# EAGLE design talkie (EAGLE 9.1.1)

## Sheet 1 of 2: ANALOG
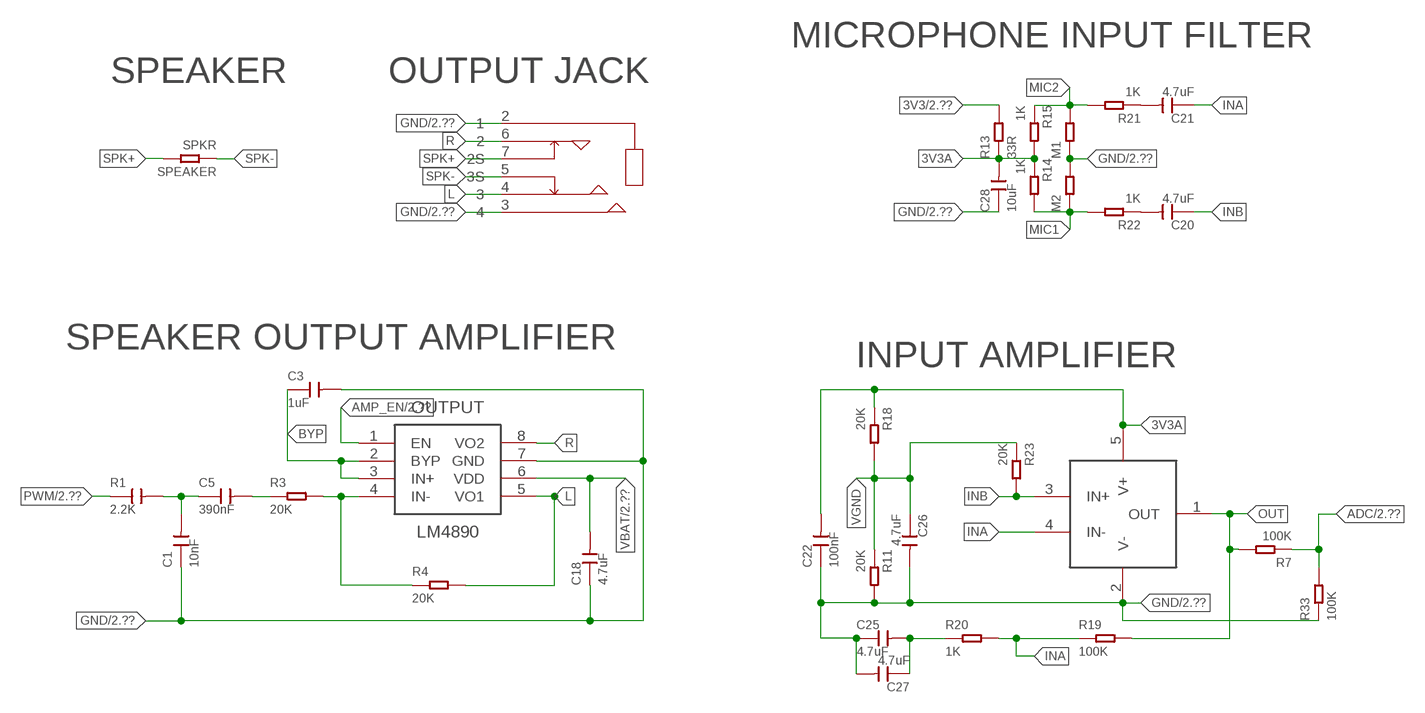
[diagram p0: schematic, sheet 1]

### Parts
C1  10nF  CERAMIC-10NF-50V-10%-X7R(0402)  [C0402]
C3  1uF  CERAMIC-1UF-10V-10%-X5R(0402)  [C0402]
C5  390nF  CERAMIC-470NF-10V-10%-X5R(0402)  [C0402]
C18  4.7uF  CERAMIC-4.7UF-6.3V-20%-X5R(0402)  [C0402]
C20  4.7uF  CERAMIC-4.7UF-6.3V-20%-X5R(0402)  [C0402]
C21  4.7uF  CERAMIC-4.7UF-6.3V-20%-X5R(0402)  [C0402]
C22  100nF  CERAMIC-100NF-25V-10%-X7R(0402)  [C0402]
C25  4.7uF  CERAMIC-4.7UF-6.3V-20%-X5R(0402)  [C0402]
C26  4.7uF  CERAMIC-4.7UF-6.3V-20%-X5R(0402)  [C0402]
C27  4.7uF  CERAMIC-4.7UF-6.3V-20%-X5R(0402)  [C0402]
C28  10uF  CERAMIC-10UF-10V-10%-X5R(0603)  [C0603]
JACK  PJ-342  [PJ-342-6P]
M1  RES-1206  [R1206]
M2  RES-1206  [R1206]
OUTPUT  LM4890  [8-MSOP]
PREAMP  MCP6001UT-I  [SOT-23-5]
R1  2.2K  CERAMIC-10NF-50V-10%-X7R(0402)  [C0402]
R3  20K  RES-0402  [R0402]
R4  20K  RES-0402  [R0402]
R7  100K  SMD-RES-100K-1%-1/16W(0402)  [R0402]
R11  20K  RES-0402  [R0402]
R13  33R  SMD-RES-33R-1%-1/16W(0402)  [R0402]
R14  1K  SMD-RES-1.5K-5%-1/16W(0402)  [R0402]
R15  1K  SMD-RES-1.5K-5%-1/16W(0402)  [R0402]
R18  20K  RES-0402  [R0402]
R19  100K  SMD-RES-100K-1%-1/16W(0402)  [R0402]
R20  1K  SMD-RES-1K-5%-1/16W(0402)  [R0402]
R21  1K  SMD-RES-1.5K-5%-1/16W(0402)  [R0402]
R22  1K  SMD-RES-1.5K-5%-1/16W(0402)  [R0402]
R23  20K  RES-0402  [R0402]
R33  100K  SMD-RES-100K-1%-1/16W(0402)  [R0402]
SPEAKER  SPKR  RES-1206  [R1206]

### Nets
3V3: R13.2 ; also sheet 2
3V3A: C22.2 C28.2 PREAMP.5(V+) R13.1 R14.1 R15.2 R18.1
ADC: R7.1 R33.2 ; also sheet 2
AMP_EN: OUTPUT.1(EN) ; also sheet 2
BYP: C3.1 OUTPUT.2(BYP) OUTPUT.3(IN+)
DAC: OUTPUT.4(IN-) R3.2 R4.1
GND: C1.1 C3.2 C18.1 C22.1 C25.1 C26.2 C27.2 C28.1 JACK.2 JACK.3 M1.1 M2.2 OUTPUT.7(GND) PREAMP.2(V-) R11.2 R33.1 ; also sheet 2
HIGHPASS: C5.2 R3.1
INA: C21.1 PREAMP.4(IN-) R19.1 R20.2
INAG: C25.2 C27.1 R20.1
INB: C20.1 PREAMP.3(IN+) R23.2
L: JACK.4 OUTPUT.5(VO1) R4.2
LOWPASS: C1.2 C5.1 R1.2
MIC1: M2.1 R14.2 R22.2
MIC2: M1.2 R15.1 R21.2
N$1: C21.2 R21.1
N$2: C20.2 R22.1
OUT: PREAMP.1(OUT) R7.2 R19.2
PWM: R1.1 ; also sheet 2
R: JACK.6 OUTPUT.8(VO2)
SPK+: JACK.7(2S) SPEAKER.2
SPK-: JACK.5(3S) SPEAKER.1
VBAT: C18.2 OUTPUT.6(VDD) ; also sheet 2
VGND: C26.1 R11.1 R18.2 R23.1

### Notes on the sheet
- MICROPHONE INPUT FILTER
- SPEAKER | OUTPUT JACK
- SPEAKER OUTPUT AMPLIFIER
- INPUT AMPLIFIER

## Sheet 2 of 2: DIGITAL
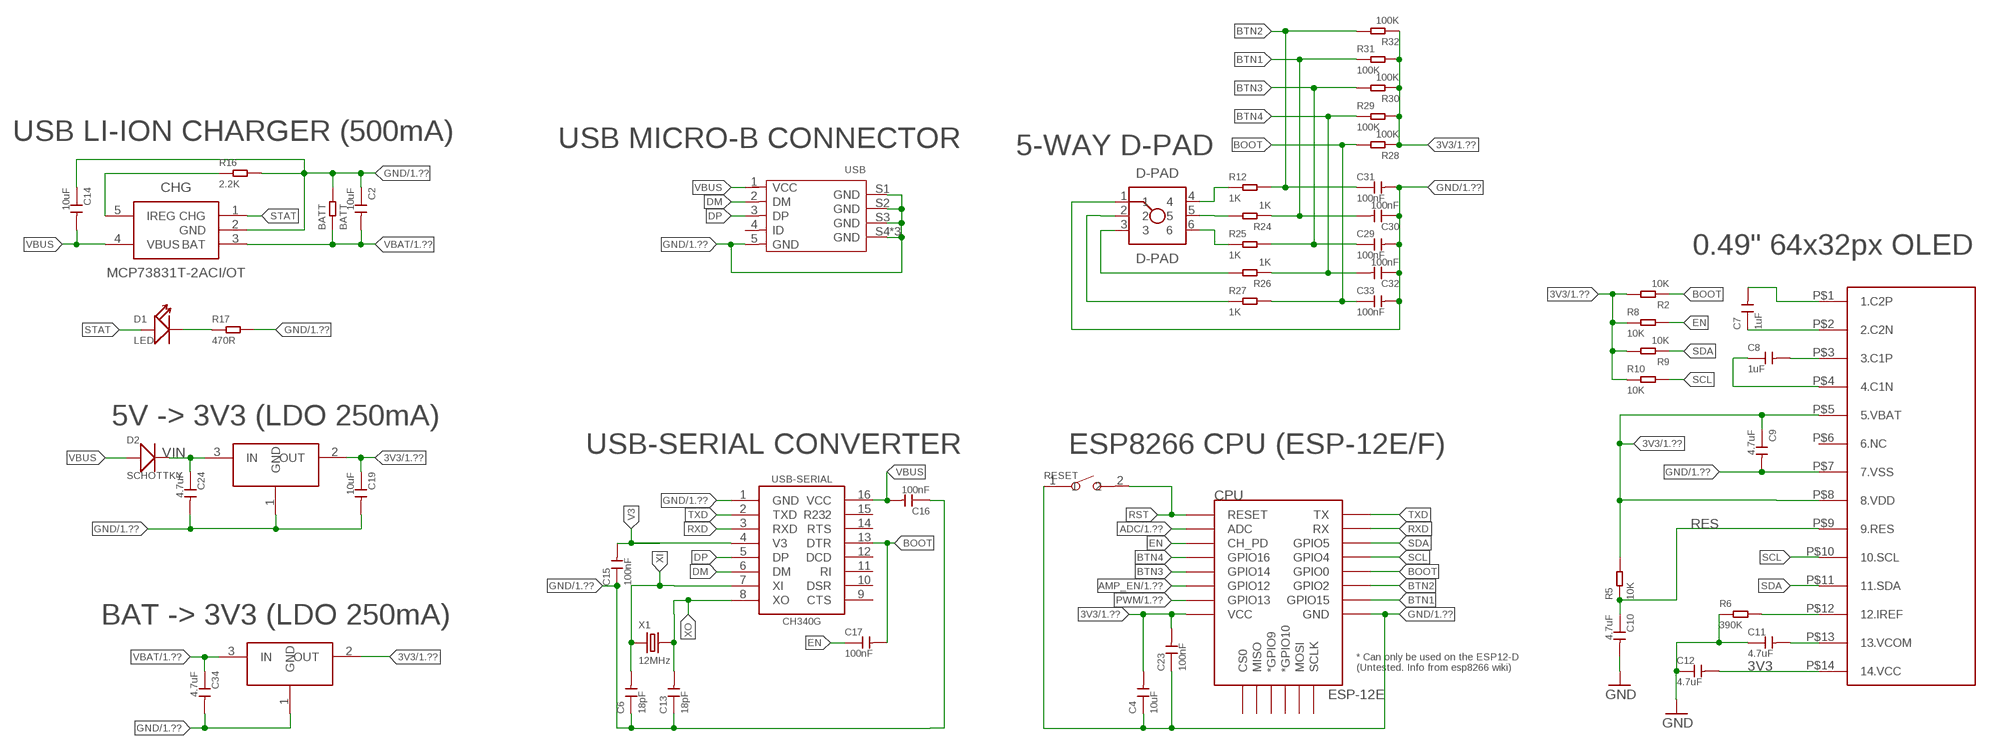
[diagram p1: schematic, sheet 2]

### Parts
BATT  BATT  RES-1206  [R1206]
C2  10uF  CERAMIC-10UF-10V-10%-X5R(0603)  [C0603]
C4  10uF  CERAMIC-4.7UF-10V-10%-X5R(0603)  [C0603]
C6  18pF  CERAMIC-18PF-50V-5%-NPO(0402)  [C0402]
C7  1uF  CERAMIC-1UF-10V-10%-X5R(0402)  [C0402]
C8  1uF  CERAMIC-1UF-10V-10%-X5R(0402)  [C0402]
C9  4.7uF  CERAMIC-4.7UF-6.3V-20%-X5R(0402)  [C0402]
C10  4.7uF  CERAMIC-4.7UF-6.3V-20%-X5R(0402)  [C0402]
C11  4.7uF  CERAMIC-4.7UF-6.3V-20%-X5R(0402)  [C0402]
C12  4.7uF  CERAMIC-4.7UF-6.3V-20%-X5R(0402)  [C0402]
C13  18pF  CERAMIC-18PF-50V-5%-NPO(0402)  [C0402]
C14  10uF  CERAMIC-10UF-10V-10%-X5R(0603)  [C0603]
C15  100nF  CERAMIC-100NF-25V-10%-X7R(0402)  [C0402]
C16  100nF  CERAMIC-100NF-25V-10%-X7R(0402)  [C0402]
C17  100nF  CERAMIC-100NF-25V-10%-X7R(0402)  [C0402]
C19  10uF  CERAMIC-10UF-10V-10%-X5R(0603)  [C0603]
C23  100nF  CERAMIC-100NF-25V-10%-X7R(0402)  [C0402]
C24  4.7uF  CERAMIC-4.7UF-6.3V-20%-X5R(0402)  [C0402]
C29  100nF  CERAMIC-100NF-25V-10%-X7R(0402)  [C0402]
C30  100nF  CERAMIC-100NF-25V-10%-X7R(0402)  [C0402]
C31  100nF  CERAMIC-100NF-25V-10%-X7R(0402)  [C0402]
C32  100nF  CERAMIC-100NF-25V-10%-X7R(0402)  [C0402]
C33  100nF  CERAMIC-100NF-25V-10%-X7R(0402)  [C0402]
C34  4.7uF  CERAMIC-4.7UF-6.3V-20%-X5R(0402)  [C0402]
CHG  MCP73831T-2ACI/OT  [SOT-23-5]
CPU  ESP-12E  ESP12ESMD  [ESP12E-SMD]
D1  LED  SMD-LED-YELLOW-DIFFUSED-PURE-WHITE(0402)  [LED-0402]
D2  SCHOTTKY  SMD-DIODE-SCHOTTKY-20V-500MA(SOD-123)  [SOD-123]
D-PAD  D-PAD  [DPAD-10X10]
LDO1  MCP1700T  [SOT-23-3]
LDO2  MCP1700T-3302E  MCP1700T  [SOT-23-3]
OLED  ER-OLED0.49  [ER-OLED0.49]
R2  10K  RES-0402  [R0402]
R5  10K  RES-0402  [R0402]
R6  390K  RES-0402  [R0402]
R8  10K  RES-0402  [R0402]
R9  10K  RES-0402  [R0402]
R10  10K  RES-0402  [R0402]
R12  1K  SMD-RES-1.5K-5%-1/16W(0402)  [R0402]
R16  2.2K  SMD-RES-2.2K-5%-1/16W(0402)  [R0402]
R17  470R  SMD-RES-470R-1%-1/16W(0402)  [R0402]
R24  1K  SMD-RES-1.5K-5%-1/16W(0402)  [R0402]
R25  1K  SMD-RES-1.5K-5%-1/16W(0402)  [R0402]
R26  1K  SMD-RES-1.5K-5%-1/16W(0402)  [R0402]
R27  1K  SMD-RES-1.5K-5%-1/16W(0402)  [R0402]
R28  100K  SMD-RES-100K-1%-1/16W(0402)  [R0402]
R29  100K  SMD-RES-100K-1%-1/16W(0402)  [R0402]
R30  100K  SMD-RES-100K-1%-1/16W(0402)  [R0402]
R31  100K  SMD-RES-100K-1%-1/16W(0402)  [R0402]
R32  100K  SMD-RES-100K-1%-1/16W(0402)  [R0402]
RESET  SMD-BUTTON(2P-3.0X2.5X1.2+0.4MM)-B3U-1000P-2P-SMD  [SW2-2.6-3.0X2.5X1.2+0.4MM]
USB  MICRO-USB-SMD-B-WITHOUT-POST-W/P(ST-USB-001G)  [MICRO-USB5+4P-SMD-0.65-B]
USB-SERIAL  CH340G  [16-SSOP]
X1  12MHz  CRYSTAL'3225'  [X4-SMD-3.2X2.5X0.7MM]

### Nets
3V3: C4.2 C9.1 C12.2 C19.1 C23.2 CPU.VCC LDO1.2(OUT) LDO2.2(OUT) OLED.P$5(5.VBAT) OLED.P$8(8.VDD) OLED.P$14(14.VCC) R2.2 R5.2 R8.1 R9.2 R10.1 R28.1 R29.2 R30.1 R31.2 R32.1 ; also sheet 1
ADC: CPU.ADC ; also sheet 1
AMP_EN: CPU.GPIO12 ; also sheet 1
B1: D-PAD.4 R12.1
B2: D-PAD.5 R24.2
B3: D-PAD.6 R25.1
B4: D-PAD.3 R26.2
B5: D-PAD.2 R27.1
BOOT: C17.2 C33.1 CPU.GPIO0 R2.1 R27.2 R28.2 USB-SERIAL.13(DTR)
BTN1: C30.2 CPU.GPIO15 R24.1 R31.1
BTN2: C31.1 CPU.GPIO2 R12.2 R32.2
BTN3: C29.1 CPU.GPIO14 R25.2 R30.2
BTN4: C32.2 CPU.GPIO16 R26.1 R29.1
C1N: C8.1 OLED.P$4(4.C1N)
C1P: C8.2 OLED.P$3(3.C1P)
C2N: C7.1 OLED.P$2(2.C2N)
C2P: C7.2 OLED.P$1(1.C2P)
DM [usb]: USB-SERIAL.6(DM) USB.2(DM)
DP [usb]: USB-SERIAL.5(DP) USB.3(DP)
EN: C17.1 CPU.CH_PD R8.2
GND: BATT.2 C2.1 C4.1 C6.1 C9.2 C10.2 C11.1 C12.1 C13.1 C14.1 C15.1 C16.1 C19.2 C23.1 C24.2 C29.2 C30.1 C31.2 C32.1 C33.2 C34.2 CHG.2(GND) CPU.GND D-PAD.1 LDO1.1(GND) LDO2.1(GND) OLED.P$7(7.VSS) R6.1 R16.2 R17.2 RESET.1 USB-SERIAL.1(GND) USB.5(GND) USB.S1(GND) USB.S2(GND) USB.S3(GND) USB.S4(GND) USB.S5(GND) USB.S6(GND) ; also sheet 1
IREF: OLED.P$12(12.IREF) R6.2
LED: D1.- R17.1
PROG: CHG.5(IREG) R16.1
PWM: CPU.GPIO13 ; also sheet 1
RES: C10.1 OLED.P$9(9.RES) R5.1
RST: CPU.RESET RESET.2
RXD: CPU.RXD0(RX) USB-SERIAL.3(RXD)
SCL: CPU.GPIO4 OLED.P$10(10.SCL) R10.2
SDA: CPU.GPIO5 OLED.P$11(11.SDA) R9.1
STAT: CHG.1(CHG) D1.+
TXD: CPU.TXD0(TX) USB-SERIAL.2(TXD)
V3: C15.2 USB-SERIAL.4(V3)
VBAT: BATT.1 C2.2 C34.1 CHG.3(BAT) LDO1.3(IN) ; also sheet 1
VBUS: C14.2 C16.2 CHG.4(VBUS) D2.+ USB-SERIAL.16(VCC) USB.1(VCC)
VCOM: C11.2 OLED.P$13(13.VCOM)
VIN: C24.1 D2.- LDO2.3(IN)
XI: C6.2 USB-SERIAL.7(XI) X1.1
XO: C13.2 USB-SERIAL.8(XO) X1.3
Unconnected: CPU.CS0 CPU.GPIO9(*GPIO9) CPU.GPIO10(*GPIO10) CPU.MISO CPU.MOSI CPU.SCLK OLED.P$6(6.NC) USB-SERIAL.9(CTS) USB-SERIAL.10(DSR) USB-SERIAL.11(RI) USB-SERIAL.12(DCD) USB-SERIAL.14(RTS) USB-SERIAL.15(R232) USB.4(ID)

### Notes on the sheet
- USB LI-ION CHARGER (500mA) | USB MICRO-B CONNECTOR
- 5-WAY D-PAD
- 0.49" 64x32px OLED
- 5V -> 3V3 (LDO 250mA)
- USB-SERIAL CONVERTER | ESP8266 CPU (ESP-12E/F)
- BAT -> 3V3 (LDO 250mA)

## Library data of the parts
BATT M1 M2 R2-R6 R8-R11 R18 R23 SPEAKER = Seeed-OPL-Resistor:RES
C1 R1 = Seeed-OPL-Capacitor:CERAMIC-10NF-50V-10%-X7R(0402): 302010006; MPN: CC0402KRX7R9BB103
C2 C14 C19 C28 = Seeed-OPL-Capacitor:CERAMIC-10UF-10V-10%-X5R(0603): 302010103; MPN: CC0603KRX5R6BB106
C3 C7 C8 = Seeed-OPL-Capacitor:CERAMIC-1UF-10V-10%-X5R(0402): 302010040; MPN: CC0402KRX5R6BB105
C4 = Seeed-OPL-Capacitor:CERAMIC-4.7UF-10V-10%-X5R(0603): 302010111; MPN: CC0603KRX5R6BB475
C5 = Seeed-OPL-Capacitor:CERAMIC-470NF-10V-10%-X5R(0402): 302010232; MPN: CC0402KRX5R6BB474
C6 C13 = Seeed-OPL-Capacitor:CERAMIC-18PF-50V-5%-NPO(0402): 302010016; MPN: CC0402JRNPO9BN180
C9-C12 C18 C20 C21 C24-C27 C34 = Seeed-OPL-Capacitor:CERAMIC-4.7UF-6.3V-20%-X5R(0402): 302010019; MPN: CC0402MRX5R5BB475
C15-C17 C22 C23 C29-C33 = Seeed-OPL-Capacitor:CERAMIC-100NF-25V-10%-X7R(0402): 302010024; MPN: CC0402KRX7R8BB104
CHG = parts:MCP73831
CPU = esp8266modules:ESP12E: ESP12E Module
D1 = Seeed-OPL-Diode:SMD-LED-YELLOW-DIFFUSED-PURE-WHITE(0402): 304090016; MPN: 16-219A/T2D-AR2T1QY/3T
D2 = Seeed-OPL-Diode:SMD-DIODE-SCHOTTKY-20V-500MA(SOD-123): 304020028; MPN: MBR0520LT1G
D-PAD = talkie:D-PAD
JACK = parts:PJ-342
LDO1 LDO2 = parts:MCP1700T
OLED = ER-OLED0.49:ER-OLED0.49
OUTPUT = talkie:LM4890
PREAMP = parts:MCP6001UT-I
R7 R19 R28-R33 = Seeed-OPL-Resistor:SMD-RES-100K-1%-1/16W(0402): 301010456; MPN: RC0402FR-07100KL
R12 R14 R15 R21 R22 R24-R27 = Seeed-OPL-Resistor:SMD-RES-1.5K-5%-1/16W(0402): 301010001; MPN: RC0402JR-071K5L; VALUE: 1.5K
R13 = Seeed-OPL-Resistor:SMD-RES-33R-1%-1/16W(0402): 301010609; MPN: RC0402FR-0733RL
R16 = Seeed-OPL-Resistor:SMD-RES-2.2K-5%-1/16W(0402): 301010039; MPN: RC0402JR-072K2L; VALUE: 2.2K 1/16W
R17 = Seeed-OPL-Resistor:SMD-RES-470R-1%-1/16W(0402): 301010012; MPN: RC0402FR-07470RL
R20 = Seeed-OPL-Resistor:SMD-RES-1K-5%-1/16W(0402): 301010006; MPN: RC0402JR-071KL
RESET = Seeed-OPL-Switch:SMD-BUTTON(2P-3.0X2.5X1.2+0.4MM): 311020047
USB = Seeed-OPL-Connector:MICRO-USB-SMD-B-WITHOUT-POST-W/P(ST-USB-001G): 320010000; MPN: ST-USB-001G
USB-SERIAL = talkie:CH340G
X1 = Seeed-OPL-crystal-osctllator_1:CRYSTAL

## Net classes
1 usb: width 0.152 mm, clearance 0.305 mm to class 0, clearance 0.203 mm

## Board
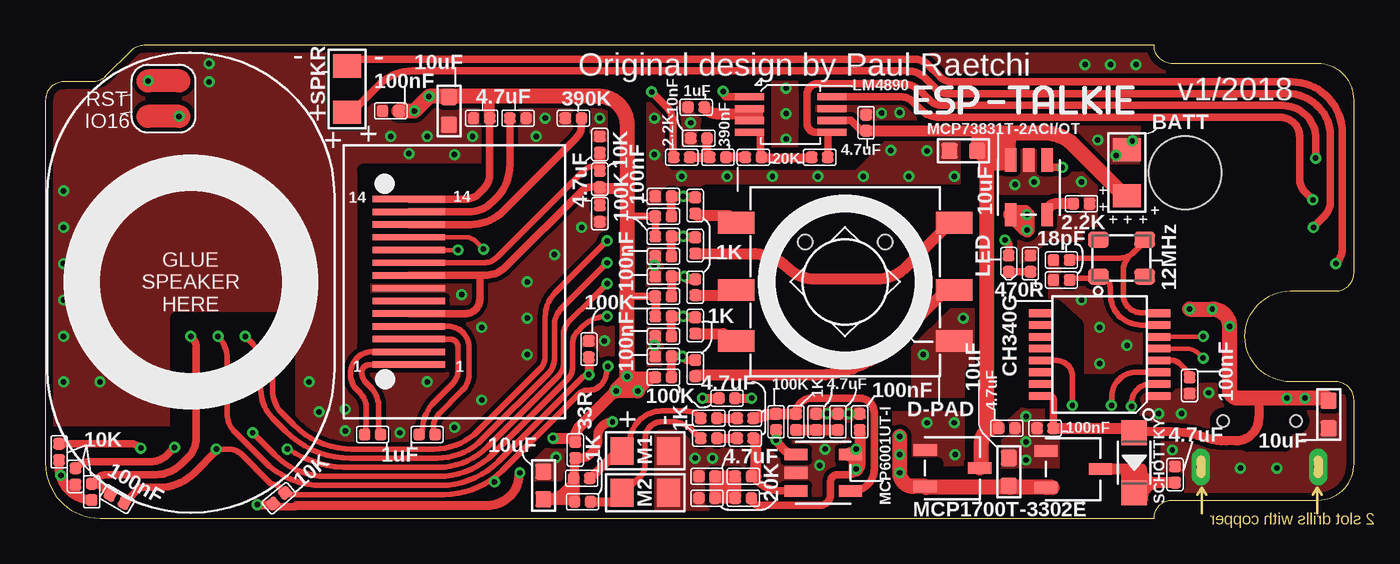
[diagram p2: board, top side]
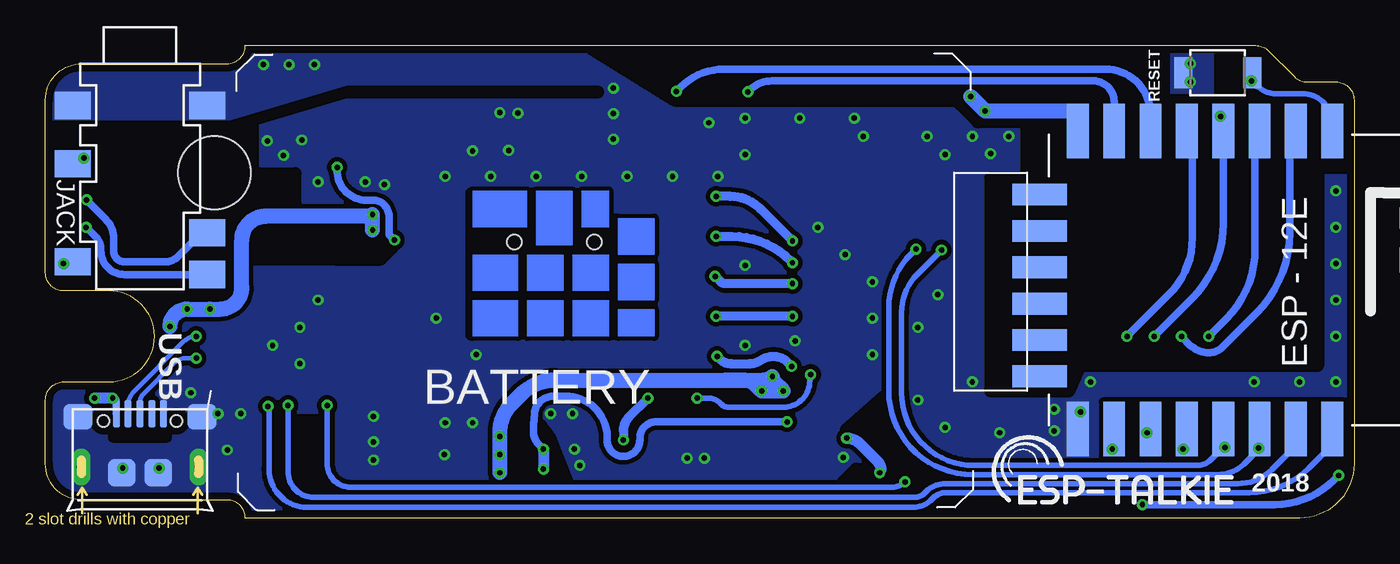
[diagram p3: board, bottom side, seen from below]

Size 72 x 26 mm. Coordinates in mm from the lower left corner, seen from the top.
Outline: 72,3 72,6.5 arc90 71,7.5 68.5,7.5 arc-180 68.5,12.5 71,12.5 arc90 72,13.5 72,23 arc90 70,25 62,25 arc-90 61,26 5.41,26 arc45 4.71,25.71 3.29,24.29 arc-45 2.59,24 1,24 arc90 0,23 0,3 arc90 3,0 61,0 arc-90 62,1 70,1 arc90 72,3
Copper layers (1*16): Top 0.035mm / dielectric 0.92mm / Bottom 0.035mm
Design rules "default *": minimum track width 6mil, minimum drill 0.3mm, track to track 6mil, track to pad 6mil, pad to pad 6mil, via to via 6mil, smd to smd 6mil, copper to edge 16mil, drill to drill 6mil, minimum pad ring 6mil, minimum via ring 6mil, stop-mask expansion 4mil, vias tented up to drill 0mil, thermal gap 10mil
Holes 4 mm at 62.7,19
tKeepout: area 16.4,5.5 to 28.6,20.5
bKeepout: area 21,0 to 62,26
tRestrict: 70 lines
bRestrict: 39 lines

### Footprints (pad centres in the part's own frame; a part is rotated, then mirrored left to right if it is on the bottom)
R1206 = smd 1.27 x 1.524: 1 -1.27,0; 2 1.27,0
C0402 = smd 0.635 x 0.635: 1 0,0.445; 2 0,-0.445
C0603 = smd 0.889 x 0.889: 1 0,0.762; 2 0,-0.762
SOT-23-5 = smd 0.635 x 1.27: 1 -1,-1.5; 2 0,-1.5; 3 1,-1.5; 4 1,1.5; 5 -1,1.5
ESP12E-SMD = smd 3 x 1.2: ADC -8.3,3.8; CH_PD -8.3,1.8; GND 8.1,-8.2; GPIO0 8.1,-2.2; GPIO2 8.1,-4.2; GPIO4 8.1,-0.2; GPIO5 8.1,1.8; GPIO12 -8.3,-4.2; GPIO13 -8.3,-6.2; GPIO14 -8.3,-2.2; GPIO15 8.1,-6.2; GPIO16 -8.3,-0.2; RESET -8.3,5.8; RXD0 8.1,3.8; TXD0 8.1,5.8; VCC -8.3,-8.2 | smd 1.2 x 3: CS0 -4.8,-10.3; GPIO9 -0.8,-10.3; GPIO10 1.2,-10.3; MISO -2.8,-10.3; MOSI 3.2,-10.3; SCLK 5.2,-10.3
LED-0402 = smd 0.635 x 0.635: + -0.445,0; - 0.445,0
SOD-123 = smd 1.397 x 1.397: + -1.651,0; - 1.651,0
DPAD-10X10 = smd 2 x 1.2: 1 -6,3.25; 2 -6,0.45; 3 -6,-3.25; 4 6,3.25; 5 6,0.45; 6 6,-3.25 | hole 0.8: -2.2,-2.2; 2.2,-2.2
PJ-342-6P = smd 1.5 x 2: 2 2.3,-3.7; 3 2.3,3.7; 4 5.5,-3.7; 5 10.9,-3.7; 6 9.3,3.7; 7 11.6,3.7
SOT-23-3 = smd 0.635 x 1.27: 1 -1,-1.5; 2 1,-1.5; 3 0,1.5
ER-OLED0.49 = smd 0.35 x 4: P$1 1.45,2; P$2 2.15,2; P$3 2.85,2; P$4 3.55,2; P$5 4.25,2; P$6 4.95,2; P$7 5.65,2; P$8 6.35,2; P$9 7.05,2; P$10 7.75,2; P$11 8.45,2; P$12 9.15,2; P$13 9.85,2; P$14 10.55,2
8-MSOP = smd 0.4 x 1.6: 1 -0.975,-2.275; 2 -0.325,-2.275; 3 0.325,-2.275; 4 0.975,-2.275; 5 0.975,2.275; 6 0.325,2.275; 7 -0.325,2.275; 8 -0.975,2.275
R0402 = smd 0.635 x 0.635: 1 0,0.445; 2 0,-0.445
SW2-2.6-3.0X2.5X1.2+0.4MM = smd 1 x 1.7: 1 -1.9,0; 2 1.9,0
MICRO-USB5+4P-SMD-0.65-B = smd 0.381 x 1.524: 1 -1.3,-0.25; 2 -0.65,-0.25; 3 0,-0.25; 4 0.65,-0.25; 5 1.3,-0.25 | smd 1.6 x 1.397: S1 -3.4,-0.427; S6 3.4,-0.427 | drill 0.508 pad 1.016 long: S2 -3.226,-3.175; S5 3.226,-3.175 | smd 1.5 x 1.5: S3 -1,-3.5; S4 1,-3.5 | hole 0.635: -2,-0.65; 2,-0.65
16-SSOP = smd 0.42 x 1.3: 1 -2.275,-3.25; 2 -1.625,-3.25; 3 -0.975,-3.25; 4 -0.325,-3.25; 5 0.325,-3.25; 6 0.975,-3.25; 7 1.625,-3.25; 8 2.275,-3.25; 9 2.275,3.25; 10 1.625,3.25; 11 0.975,3.25; 12 0.325,3.25; 13 -0.325,3.25; 14 -0.975,3.25; 15 -1.625,3.25; 16 -2.275,3.25
X4-SMD-3.2X2.5X0.7MM = smd 1.143 x 0.889: 1 -1.27,-1.016; 2 1.27,-1.016; 3 1.27,1.016; 4 -1.27,1.016

### Placement (x,y rotation side)
BATT  59.5,19 90 top
C1  35.95,20.9 90 top
C2  50.5,20.2 90 top
C3  35.8,22.6 270 top
C4  22.2,22.4 180 top
C5  37,19.85 90 top
C6  55.9,13.1 90 top
C7  18,4.6 90 top
C8  21,4.6 270 top
C9  30.5,16.75 0 top
C10  30.5,20.55 180 top
C11  26,22 270 top
C12  24,22 90 top
C13  55.9,14.2 90 top
C14  70.6,5.7 180 top
C15  62.95,7.3 180 top
C16  55,4.95 90 top
C17  3.95,1.05 60 top
C18  45.15,21.75 0 top
C19  53,2.55 180 top
C20  38.5,4.4 270 top
C21  38.5,5.5 270 top
C22  44.8,5.3 0 top
C23  19,22.4 90 top
C24  62.15,2.4 180 top
C25  43.6,5.3 0 top
C26  36.4,2.3 270 top
C27  42.4,5.3 180 top
C28  27.4,1.8 0 top
C29  34,17.7 270 top
C30  34,13.3 90 top
C31  34,10 270 top
C32  34,14.4 90 top
C33  34,8.9 270 top
C34  52.9,4.95 90 top
CHG  54.1,18.2 180 top
CPU  7,13 270 bottom
D1  53,14 270 top
D2  59.9,3.05 270 top
D-PAD  44,13 180 top
JACK  66.8,25 270 bottom
LDO1  49.9,2.75 270 top
LDO2  56.55,2.7 270 top
M1  33,3.7 180 top
M2  33,1.4 0 top
OLED  22,7 90 top
OUTPUT  41,22.2 270 top
PREAMP  42.8,2.5 270 top
R1  35.01,19.85 90 top
R2  12.85,1.1 310 top
R3  38.95,19.85 90 top
R4  42.6,19.85 90 top
R5  30.5,18.65 0 top
R6  29.05,22 90 top
R7  37.5,6.6 90 top
R8  2.55,1.45 180 top
R9  0.75,3.65 0 top
R10  1.65,2.3 180 top
R11  36.4,1.1 270 top
R12  35.75,10.6 180 top
R13  29.15,3.75 180 top
R14  29.55,0.9 90 top
R15  29.5,2.2 270 top
R16  57,17.3 90 top
R17  54.2,14 180 top
R18  38.4,1.1 270 top
R19  40.2,5.3 0 top
R20  41.3,5.3 180 top
R21  36.5,5.5 270 top
R22  36.5,4.4 270 top
R23  38.4,2.3 90 top
R24  35.75,12.7 0 top
R25  35.75,17.2 180 top
R26  35.75,15 0 top
R27  35.75,8.25 180 top
R28  34,7.75 90 top
R29  34,15.5 270 top
R30  34,16.6 90 top
R31  34,12.2 270 top
R32  34,11.1 90 top
R33  29.9,9.3 0 top
RESET  7.5,24.5 0 bottom
SPEAKER  16.6,23.6 270 top
USB  66.8,6 0 bottom
USB-SERIAL  58,9 90 top
X1  59.2,14.3 0 top

### Tracks (layer width: path | path; a pad name or v marks a point on that pad's centre or on a via)
3V3  (via drill 0.3)
  Top 0.305: 30.5,18.22 arc-45 30.53,18.15 | 12.35,0.75 arc45 R2.2 | v0.85,2.35 arc-90 0.75,2.45 0.75,2.81 0.75,2.76 arc90 R10.1 arc90 2.5,1.01 R8.1
  Top 0.406: OLED.P$14 23.14,17.55 arc45 23.84,17.84 24.08,18.08 arc45 24.45,18.96 C12.2 | 23.9,13.35 24.14,13.35 arc45 25.36,13.86 29.43,17.93 arc-45 30.14,18.22 30.5,18.22 | OLED.P$5 23.1,11.25 arc90 23.9,12.05 23.9,13.35 | OLED.P$8 23.9,13.35 | R29.2 R30.1 32.1,16.6 32,16.7 | R31.2 32,12.2 | 13.82,0.7 arc-45 13.73,0.62 12.48,0.62 | 12.48,0.62 12.5,0.65 | R2.2 12.51,0.67 arc-45 12.5,0.65 | 12.5,0.65 12.48,0.62
  Top 0.508: R31.2 R32.1 | 13.82,0.7 24.26,0.7 arc45 25.6,1.26 arc45 26.05,2.35 26.1,2.4 v26.1,2.5 | 12.35,0.75 12,0.75 v11.65,0.75 | 0.75,2.81 R9.2 0.75,2.81 | R8.1 arc-90 0.75,2.81
  Top 0.61: 30.5,18.22 R5.2 C9.1 | 30.53,18.15 32,18.15 | C12.2 24.45,23.2 | 31.32,6.96 arc-45 v31.4,7 | R13.2 29.15,4.39 | 29.15,4.39 arc-45 29.44,5.09 31.32,6.96 | v27.92,4.4 29.12,4.4 arc-45 29.15,4.39 | 32.55,7 v32.6,7 33.2,7.61 arc-45 R28.1 32.12,7.75 arc-45 v32,7.8 | 31.35,7 31.32,6.96
  Top 0.813: v32,7.8 32,8.01 | C23.2 v20.3,22.4 21.06,23.16 arc45 v21.1,23.2 22.16,23.2 C4.2 22.24,23.2 24.45,23.2 30.39,23.2 arc-90 32,21.73 32,18.15 32,16.7 32,12.5 32,12.4 32,12.3 32,12.2 32,8.7 | 32,8.7 32,8.01 | v47,3.5 v47,4.5 v47,2.5 arc90 47.75,1.75 LDO1.2 48.45,1.7 LDO2.2 55.15,1.7 55.4,1.7 53.09,1.7 C19.1 | v32,7.8 32,7.75 arc-45 31.89,7.49 v31.4,7 v32.6,7 32.14,7.46 arc-45 v32,7.8 | v32,7.8 32,8.01 | 32,8.01 32,8.7 | 32.03,7.99 32,8.01
  Bottom 0.406: v27.92,4.4 v27.91,4.4 | v0.85,2.35 1.1,2.1 arc45 4.36,0.75 v11.65,0.75
  Bottom 0.61: v26.1,2.5 arc45 26.03,2.67 arc-45 26.21,3.11 27.21,4.11 arc-45 v27.91,4.4
  Bottom 0.813: CPU.VCC 15.2,22.4 v20.3,22.4 v21.1,23.2 | v47,2.5 47,4.69 arc45 46.32,6.33 45.83,6.82 arc45 43.94,7.6 34.6,7.6 | v32.01,7.79 v32,7.8 | 32.47,7.6 arc-45 v32.01,7.79 | 34.6,7.6 32.47,7.6 | 32.47,7.6 arc-45 32.6,7.29 v32.6,7 | v32.01,7.79 arc-45 31.88,7.48 v31.4,7 v32.6,7 | v32.6,7 32.91,7.31 arc-45 33.61,7.6 34.6,7.6
3V3A  (via drill 0.3)
  Top 0.406: R18.1 arc90 39.24,0.7 42.6,0.7 arc90 43.2,1.3 43.2,2 arc-90 43.6,2.4 44.2,2.4 arc90 44.8,3
  Top 0.508: R15.2 arc-45 29.1,2.21 R13.1 29.41,3.31 arc45 30,3.55 30.11,3.66 arc45 30.4,4.36 30.4,4.5 arc-90 v31.2,5.3
  Top 0.61: C28.2 28.82,1.04 arc-45 R14.1 29.11,2.2 R15.2 29.11,1.95 28.63,1.47 arc-45 27.58,1.04 | C22.2 44.8,3 44.8,2.9 arc-90 v44.6,2.7
  Top 0.813: PREAMP.5 arc-90 44.6,3.2 v44.6,2.7
  Bottom 0.406: v31.2,5.3 38.4,5.3 arc-90 39.3,4.4 39.3,4.3 arc180 41.1,4.3 arc-95 43.4,6.7 44,6.7 arc-90 45.1,5.75 45.15,5.15 45.15,4.76 arc-45 44.86,4.06 v44.6,3.8
  Bottom 0.61: v44.6,3.8 v44.6,2.7
ADC  (via drill 0.3)
  Top 0.305: v9.5,10 arc-45 10,8.79 10,5.77 arc45 10.44,4.71 12.02,3.13 arc45 15.23,1.8 21.72,1.8 arc45 24.93,3.13 29.51,7.71 arc-45 29.96,7.89 v29.9,7.9
  Top 0.508: R33.2 29.9,7.95 29.96,7.89 | v36.15,6.6 R7.1
  Bottom 0.305: 31.4,6.1 arc-90 29.95,7.55 v29.9,7.9 | 31.4,6.1 arc-90 31.4,6.1 | 31.4,6.1 34.37,6.1 arc45 34.85,6.3 34.86,6.31 arc-45 35.56,6.6 v36.15,6.6 | v36.15,6.6 36.25,6.6 v36.15,6.6
  Bottom 0.406: CPU.ADC 3.55,20.95 3.55,15.66 arc45 5.36,11.29 7.24,9.41 arc45 7.99,9.1 arc45 9.02,9.52 v9.5,10
AMP_EN  (via drill 0.3)
  Top 0.406: OUTPUT.1 37.51,23.18 arc-45 37.35,23.23 37.34,23.42 v37.28,23.48
  Bottom 0.406: CPU.GPIO12 11.2,22.2 arc-90 13.7,24.7 34.68,24.7 arc-45 37.03,23.73 v37.28,23.48
B1
  Top 0.61: R12.1 37.29,10.15 37.48,9.96 arc45 D-PAD.4
B2
  Top 0.61: R24.2 37.71,12.26 D-PAD.5
B3
  Top 0.406: 37.59,16.66 D-PAD.6
  Top 0.61: 37.59,16.66 35.85,16.66 R25.1
B4
  Top 0.406: 49.8,16.25 D-PAD.3
  Top 0.61: R26.2 38.82,14.56 arc-45 40.8,13.81 40.81,13.8 arc45 42.36,13.16 45.72,13.16 arc45 47.41,13.86 49.8,16.25
B5
  Top 0.406: D-PAD.2 49.55,12.55
  Top 0.61: 49.55,12.55 46.6,9.6 arc-45 42.39,7.86 35.75,7.86 35.7,7.81 R27.1
BOOT  (via drill 0.3)
  Top 0.254: 25.11,2.61 24.7,2.2 v24.7,2
  Top 0.305: v30.95,8.35 30.9,8.4 arc-40 30.61,7.37 30.52,7.28 arc-45 29.97,7.05 29.83,7.05 arc45 29.35,6.85 25.11,2.61 arc-45 21.93,1.29 13.41,1.29 arc-45 R2.1 12.81,1.76 arc45 12.6,1.85 arc-45 12.34,1.96 10.79,3.51 arc45 10.09,3.8 v9.4,3.8 | USB-SERIAL.13 55.62,8.68 arc-90 56.5,7.8 v56.5,6.2
  Top 0.406: C33.1 v35.05,8.9 35.26,8.69 R27.2 | C17.2 5.01,1.51 arc-45 5.48,1.7 6.26,1.7 arc45 8.2,2.5 9.4,3.7 v9.4,3.8
  Top 0.508: R28.2 C33.1
  Bottom 0.305: v56.5,6.2 56.5,3 arc-90 55.2,1.7 25.4,1.7 arc-42 v24.7,2
  Bottom 0.508: v35.05,8.9 34.91,8.76 arc-45 34.28,8.5 33.25,8.5 arc-34 32.61,8.71 arc67 31.31,8.71 v30.95,8.35
  Bottom 0.61: CPU.GPIO0 9.2,4.4 arc-90 9.1,4.3 v9.4,3.8
BTN1  (via drill 0.3)
  Top 0.305: v13.3,3.8 13.34,3.8 arc30 16.41,2.8 21.6,2.8 arc45 24.33,3.93 28.21,7.81 arc45 28.5,8.51 28.5,10.09 arc-45 28.79,10.79 30.08,12.08 v30.9,12.9
  Top 0.406: 35.31,13.14 v35.15,13.3
  Top 0.508: R31.1 C30.2 v35.15,13.3 | R24.1 35.31,13.14
  Bottom 0.305: CPU.GPIO15 13.2,4 arc-90 v13.3,3.8
  Bottom 0.508: v30.9,12.9 34.58,12.9 arc45 34.87,13.02 v35.15,13.3
BTN2  (via drill 0.3)
  Top 0.305: v30.9,11.1 arc45 29.53,10.53 29.29,10.29 arc45 29,9.59 29,8.31 arc-45 28.71,7.61 24.66,3.56 arc-45 21.61,2.3 15.46,2.3 arc-45 12.62,3.48 v11.4,4.7
  Top 0.406: 35.16,11.04 v35.1,11.1
  Top 0.508: C31.1 R32.2 v35.1,11.1 | R12.2 35.16,11.04
  Bottom 0.508: v35.1,11.1 31,11.1 v30.9,11.1
  Bottom 0.61: v11.4,4.7 11.4,4.75 arc-90 11.25,4.9 CPU.GPIO2
BTN3  (via drill 0.3)
  Top 0.305: v30.9,15.25 28.04,12.39 arc45 27.5,11.09 27.5,8.91 arc-45 27.21,8.21 23.8,4.8 arc-45 21.39,3.8 16.89,3.8 arc-45 13.67,5.13 12.99,5.81 arc-45 12.5,7 v12.5,10
  Top 0.406: 35.16,17.64 v35.1,17.7
  Top 0.508: R30.2 C29.1 v35.1,17.7 | R25.2 35.16,17.64
  Bottom 0.406: CPU.GPIO14 8.9,21 8.9,15.42 arc45 10.19,12.31 v12.5,10
  Bottom 0.508: v30.9,15.25 32.67,17.02 arc-45 34.31,17.7 v35.1,17.7
BTN4  (via drill 0.3)
  Top 0.305: v11,10 11.28,9.72 arc-45 11.85,8.35 11.85,7.06 arc45 12.49,5.51 13.21,4.79 arc45 16.81,3.3 21.54,3.3 arc45 24.03,4.33 27.71,8.01 arc45 28,8.71 28,10.59 arc-45 28.4,11.55 v30.9,14.05
  Top 0.406: 35.16,15.44 v35.1,15.5
  Top 0.508: v35.1,15.5 R29.1 C32.2 | R26.1 35.16,15.44
  Top 1.27: v7.35,22.1 5.65,22.1
  Bottom 0.406: v11,10 8.91,12.09 arc-45 7.2,16.21 7.2,20.55 v7.35,22.1 CPU.GPIO16
  Bottom 0.508: v35.1,15.5 34.23,15.5 arc45 31.02,14.17 v30.9,14.05
BYP
  Top 0.305: OUTPUT.3 38.57,22.03 arc-45 38.5,22.2 38.54,22.3 38.56,22.35 arc-45 38.57,22.37 OUTPUT.2
  Top 0.61: 38.5,22.2 39.2,22.2 | C3.1 arc53 36.94,22.25 38.46,22.25 38.56,22.35
C1N
  Top 0.305: OLED.P$4 22.15,10.55 arc-90 23.3,9.4 23.3,7.91 arc-45 22.94,7.04 21.66,5.75 arc45 21.34,5.01 21.34,4.7 C8.1
C1P
  Top 0.305: OLED.P$3 22.25,9.85 arc-90 22.7,9.4 22.7,8.11 arc-45 22.41,7.41 21.41,6.41 arc45 20.73,4.78 C8.2
C2N
  Top 0.305: OLED.P$2 17.95,9.15 arc90 16.8,8 16.8,7.81 arc45 17.09,7.11 17.3,6.9 arc-45 17.66,6.04 17.66,4.7 C7.1
C2P
  Top 0.305: OLED.P$1 17.85,8.45 arc90 17.4,8 arc45 17.61,7.49 17.84,7.26 arc-45 18.34,6.04 18.34,4.7 C7.2
DAC
  Top 0.406: OUTPUT.4 39.34,21.23 39.34,19.9 R3.2
  Top 0.508: R4.1 42.1,19.8 39.44,19.8 R3.2
DM  (via drill 0.3)
  Top 0.254: v63.7,10 arc45 63.73,9.97 USB-SERIAL.6
  Bottom 0.254: USB.2 67.45,6.19 arc45 67.12,6.98 64.38,9.72 arc45 v63.7,10
DP  (via drill 0.3)
  Top 0.254: v63.7,8.8 63.47,9.03 arc45 62.76,9.32 USB-SERIAL.5
  Bottom 0.254: USB.3 66.8,6.34 arc45 66.58,6.87 64.93,8.52 arc45 64.25,8.8 v63.7,8.8
EN  (via drill 0.3)
  Top 0.406: v8,10 8.07,9.93 arc-45 8.3,9.38 8.3,4.6 8.3,4.4 arc-45 7.88,3.38 7.46,2.96 arc-45 6.12,2.4 3.4,2.4 arc45 2.81,2.16 R8.2 arc-45 3.22,1.62 C17.1
  Bottom 0.406: CPU.CH_PD 5.45,21.05 5.45,14.79 arc45 7.04,10.96 v8,10
GND  (via drill 0.3)
  other vias: 35.5,21.75 22.9,12.3 29.5,16 42.5,18.8 40,18.8 37.5,18.8 35,18.8 33.5,22 30.5,22 27.5,22 21,21 3,7.5 59.5,9.5 58.9,19.95 1,7.5 1,18 1,16 1,14 1,12 1,10 40.75,23.65 40.75,20.85 64,6.9 46.01,22.27 47,22.3 57.9,20.8 59.8,20.75 16.5,6 65.75,2.75 67.75,2.75 19,21 54.4,18.5 47.5,18.8 45,18.8 33.5,20 50,18.8 57,12 23.5,21 36.7,3.3 35.75,3.3 28.1,3.35 48.5,5.25 50,5.25 19.5,4.7 26.5,9 62.5,5.75 58,8.5 48.5,20.2 14.5,7.5 22.5,5 43,5.75 44.2,5.75 42.6,2.9 42.9,3.8 22.5,20 16.5,4.8 28,14.5 40.75,22.25 33.5,9.5 33.5,13.9 26.5,11 26.5,13 24,6.5 24,10.5 21,7.5 5.5,7.5 27,21 20,20.05 48.3,9 58,10.5 50.5,11 9,24 9,25 57,18.5 50.05,3.5 61.25,5.75 53.95,5.6 53.95,4.2 53.95,3.2 53.35,18.35 62,3.75 46.51,20.22 30.75,9.75 15.05,5.85 60,24.95 58.6,24.95 57.2,24.95
  pour Top (isolate 0.254, no thermals): 0,1 0,25 1,26 47,26 70,26 72,24 72,16 72,2 70,0 1,0
  pour Bottom (isolate 0.254, no thermals): 0,26 0,0 70,0 72,2 72,16 72,21 72,24 70,26 47,26
HIGHPASS
  Top 0.508: R3.1 C5.2
INA
  Top 0.305: PREAMP.4 44.4,1.5
  Top 0.406: 44.4,1.5 arc90 45.6,2.7 45.6,5.8 arc90 44.8,6.6 42.16,6.6 arc90 R20.2
  Top 0.61: C21.1 39.07,5.5 arc-20 R19.1 R20.2
INAG
  Top 0.61: R20.1 C27.1 C25.2
INB
  Top 0.406: R23.2 38.84,2.4 arc60 40.65,1.5 PREAMP.3
  Top 0.61: R23.2 arc90 38.84,2.4 R23.2 | R23.2 39.1,2.3 39.1,4.34 arc90 C20.1
IREF
  Top 0.406: OLED.P$12 23.39,16.15 arc45 25.2,16.9 29.2,20.9 arc45 29.49,21.61 R6.2
L  (via drill 0.3)
  Top 0.406: R4.2 43.04,21.18 43,21.23 | OUTPUT.5 43,21.23 | 43,21.23 42.38,21.23 arc-90 41.9,21.7 41.9,23.3 arc-90 42.5,23.9 47.09,23.9 arc-45 48.22,23.43 48.66,22.99 arc45 49.36,22.7 68.05,22.7 arc-90 69.9,20.85 69.9,19.82 arc-90 v69.89,19.8
  Bottom 0.406: JACK.4 70.19,19.5 arc-90 v69.89,19.8
  Bottom 0.813: JACK.4 70.4,19.6
LED
  Top 0.406: D1.- 53.6,13.56 R17.1
LOWPASS
  Top 0.508: R1.2 C5.1 | 36.4,19.84 C1.2
  Top 0.61: 36.4,19.84 36.54,19.84 C5.1
MIC1
  Top 0.305: R22.2 36.06,4.34 35.51,4.89 arc45 34.52,5.3 33.9,5.3 arc90 33,4.4 33,2.98 arc-45 32.71,2.28 31.83,1.4 M2.1
  Top 0.508: R14.2 31.43,0.9 M2.1
MIC2
  Top 0.305: M1.2 32.13,4.1 arc-90 33.93,5.9 34.6,5.9 35.16,5.9 arc-45 36.12,5.5 R21.2
  Top 0.508: M1.2 31.5,3.7 29.99,2.19 R15.1
N$1
  Top 0.508: R21.1 C21.2
N$2
  Top 0.508: R22.1 C20.2
OUT  (via drill 0.3)
  Top 0.508: PREAMP.1 arc-45 40.62,3.78 v40.2,4.3 R19.2 | R7.2 v38.85,6.6
  Bottom 0.508: v38.85,6.6 39.91,5.54 arc-45 40.2,4.84 v40.2,4.3
PROG
  Top 0.61: R16.1 55.63,17.3 arc90 55.1,16.77 CHG.5
PWM  (via drill 0.3)
  Top 0.406: v33.35,23.45 34.17,22.63 arc-45 34.52,21.79 34.52,19.9 R1.1
  Bottom 0.406: CPU.GPIO13 13.2,22.9 arc-90 14.35,24.05 32.03,24.05 arc-45 33.26,23.54 v33.35,23.45
R  (via drill 0.3)
  Top 0.406: v69.74,17.51 69.29,17.95 arc-45 69,18.66 69,21 arc90 67.95,22.05 49.16,22.05 arc-45 48.21,22.44 47.77,22.88 arc45 47.06,23.18 OUTPUT.8
  Bottom 0.406: JACK.6 arc-45 63.61,15.49 64.71,14.39 arc45 65.41,14.1 67.65,14.1 arc90 68.25,14.7 68.25,15.39 arc-45 68.68,16.43 69.73,17.48 arc45 v69.74,17.51
  Bottom 0.813: 63.41,16.01 JACK.6
RES
  Top 0.305: OLED.P$9 24.14,14.05 arc45 24.84,14.34 29.61,19.11 arc-45 30.31,19.4 30.5,19.4
  Top 0.61: R5.1 30.5,19.4 C10.1
RST  (via drill 0.3)
  Top 1.27: 7.35,24.05 v5.65,24.05
  Bottom 0.305: CPU.RESET 1.2,21.7 arc-90 2.85,23.35 4.29,23.35 arc45 5.33,23.78
  Bottom 0.406: 5.33,23.78 5.33,23.86 arc-45 RESET.2 v5.65,24.05
RXD  (via drill 0.3)
  Top 0.305: USB-SERIAL.3 60,8.03 arc90 58.67,6.7 58.67,6.22 v58.65,6.2
  Bottom 0.152: CPU.RXD0 3.2,4.65 3.2,4.5 arc90 2.78,3.98
  Bottom 0.305: v58.65,6.2 58.65,2.56 arc-90 57.24,1.15 24.19,1.15 arc-45 23.61,1.39 23.53,1.47 arc45 22.49,1.9 6.39,1.9 arc-45 4.53,2.67 3.49,3.71 arc-45 3.2,4.41 3.2,4.65
SCL  (via drill 0.3)
  Top 0.254: v22.7,14.75 OLED.P$10
  Top 0.406: R10.2 1.71,2.81 arc-45 2.42,3.1 5.79,3.1 arc45 6.66,3.46 7.05,3.85 v7.1,3.9
  Bottom 0.305: v22.7,14.75 24.03,13.42 arc-45 24.9,11.32 24.9,6.9 arc-90 20.9,2.9 8.67,2.9 arc-45 7.87,3.23 7.56,3.54 arc-45 7.2,4.41 CPU.GPIO4
  Bottom 0.61: v7.1,3.9 7.1,4.8 CPU.GPIO4
SDA  (via drill 0.3)
  Top 0.254: OLED.P$11 23.14,15.45 arc-45 23.67,15.23 v24.1,14.8
  Top 0.406: R9.1 4.69,4.09 arc-45 5.23,3.87 v5.25,3.85
  Bottom 0.305: v24.1,14.8 24.38,14.52 arc-45 25.6,11.57 25.6,7 arc-90 21,2.4 7.46,2.4 arc-45 6.08,2.97 5.49,3.56 arc-45 5.2,4.26 CPU.GPIO5
  Bottom 0.61: CPU.GPIO5 5.2,3.9 arc-90 5,3.7 5.1,3.7 v5.25,3.85
SPK+  (via drill 0.3)
  Top 0.406: SPEAKER.2 16.85,22.33 18.36,23.84 arc-45 20.2,24.6 47.41,24.6 arc-45 48.41,24.19 48.96,23.64 arc45 49.66,23.35 68.35,23.35 arc-90 70.7,21 70.7,17.49 arc-45 70.31,16.54 v69.76,16
  Bottom 0.406: JACK.7 67.65,13.4 arc90 68.95,14.7 68.95,14.77 arc-45 69.24,15.47 v69.76,16
  Bottom 0.813: JACK.7 63.2,13.3
SPK-  (via drill 0.3)
  Top 0.406: SPEAKER.1 16.66,24.93 arc-45 17.43,25.25 47.77,25.25 arc-45 48.59,24.91 49.21,24.29 arc45 49.91,24 68.55,24 arc-90 71.35,21.2 71.35,14.84 arc-45 v71.01,14.01 v71,14
  Bottom 0.406: JACK.5 70.76,14.1 arc-45 v71,14
STAT  (via drill 0.3)
  Top 0.406: D1.+ 53,15.1 v52.8,15.3 | v55.95,19.3 55.25,19.3 arc-90 CHG.1
  Bottom 0.406: v55.95,19.3 arc-90 54.5,17.5 54,17.5 arc90 53.1,16.6 53.1,15.6 v52.8,15.3
TXD  (via drill 0.3)
  Top 0.305: v59.75,6.15 59.75,6.33 arc-90 60.8,7.38 USB-SERIAL.2
  Bottom 0.152: CPU.TXD0 1.28,4.8 1.6,4.4
  Bottom 0.305: 1.28,4.8 1.28,4.43 arc45 1.61,3.64 2.5,2.75 arc45 5.76,1.4 22.49,1.4 arc-45 23.11,1.14 23.22,1.03 arc45 24.26,0.6 57.6,0.6 arc90 59.7,2.7 59.7,6.1 v59.75,6.15
V3
  Top 0.254: C15.2 63.05,7.85
  Top 0.305: 63.05,7.85 62.38,8.52 arc45 62.01,8.68 USB-SERIAL.4
VBAT
  Top 0.305: 52.1,19.7 52.1,19.75 arc90 51.65,20.2 | C2.2 51.26,20.15 arc90 51.8,19.61 arc-90 51.85,19.56 51.85,19.4
  Top 0.406: OUTPUT.6 44.33,21.88 44.9,21.3 C18.2
  Top 0.61: C18.2 51.3,21.3 | 51.3,21.3 53,21.3 arc-90 53.1,21.21 53.1,20.7 | 59.8,17.9 59.31,17.9 | 53.1,20.2 CHG.3 52.1,19.7 51.95,19.7 C2.2 | 53.1,20.2 53.1,20.7 | C2.2 51.65,20.2 53.1,20.2 | C2.2 51.26,20.8 | 51.26,20.8 51.26,21.27 arc-90 51.3,21.3 | 51.26,20.8 53,20.8 arc-90 53.1,20.7 | 51.8,5.04 C34.1 52.34,5.03 | 53,19.4 51.85,19.4
  Top 0.813: 53.1,21.21 54.91,21.21 arc-45 56.59,20.51 59.06,18.04 arc45 59.31,17.9 | BATT.1 arc45 59.72,17.82 59.8,17.9 | 52.34,5.03 arc90 51.5,4.19 51.5,2.85 LDO1.3 | C2.2 arc-90 51.8,19.61 51.8,5.04
VBUS  (via drill 0.3)
  Top 0.406: 55.44,5.19 C16.2 55.44,6.53 arc90 55.25,6.72 USB-SERIAL.16
  Top 0.508: 66.75,6.6 66.75,5.5 arc-90 65.5,4.25 64.95,4.25 arc-19 63.75,4.45 arc19 61.95,4.75 59.95,4.75 D2.+ | 55.45,4.96 C16.2
  Top 0.61: C16.2 59.3,4.95 arc-45 D2.+
  Top 0.813: C14.2 arc90 70.46,6.6 v69.3,6.6 v68.3,6.6 66.75,6.6 65.65,6.6 arc-94 65.15,7.1 v65.15,10.55 arc90 v64.2,11.5 v62.95,11.5 | 53.45,16.4 v54,15.85 v54,16.7 53.9,16.8 53.2,16.8 CHG.4
  Bottom 0.406: USB.1 68.1,6.45 arc-90 v68.3,6.6
  Bottom 0.61: v68.3,6.6 v69.3,6.6
  Bottom 0.813: v54,15.85 v54,16.7 54.1,16.6 59.9,16.6 arc-90 61.2,15.3 61.2,12.7 arc90 62.35,11.5 v62.95,11.5 v64.2,11.5 arc-90 v65.15,10.55
VCOM
  Top 0.406: OLED.P$13 23.28,16.85 arc45 24.6,17.4 24.79,17.59 arc45 25.55,19.43 C11.2
VGND
  Top 0.61: 37.3,2.3 R23.1 37.96,1.6 | 37.3,2.3 C26.1 R11.1 37.4,1.1 | 37.96,1.6 R18.2 37.4,1.1 | 37.3,2.3 37.3,1.2 arc90 37.4,1.1 | 37.3,2.3 37.3,2.26 arc90 37.96,1.6
VIN
  Top 0.61: 60.3,2.7 60,2.7 | 60,2.7 59.5,2.7 | 59.5,2.7 LDO2.3 | D2.- arc-90 59.5,1.8 59.5,2.7 | D2.- 59.9,2.6 arc-90 60,2.7 | D2.- arc90 60.3,1.8 60.3,2.7 | 60.3,2.7 arc90 61.04,1.96 C24.1 61.25,1.96 arc90 60.35,1.06 60.35,1 60.3,1 arc-90 D2.-
XI
  Top 0.305: C6.2 56.34,13.18 56.36,13.18 57.83,13.18 X1.1 arc-90 58.6,12.61 58.6,12.3 arc90 60.27,10.62 USB-SERIAL.7
XO
  Top 0.305: 60.28,15.02 59.95,14.69 arc-45 59.14,14.3 56.44,14.3 C13.2 | X1.3 60.28,15.12 60.28,15.02 | 60.28,15.02 59.59,14.34 arc45 59.3,13.63 59.3,12.3 arc90 60.3,11.3 61.23,11.3 arc-90 USB-SERIAL.8
(copper drawn outside any net)
  shapes: Bottom area x12

### Text on the board
tPlace: - | - | Original design by Paul Raetchi | v1/2018 | RST / IO16 | + | + | + | 14 | 14 | + | + | + | + | + | + | GLUE / SPEAKER / HERE | 1 | 1 | + | -
bPlace: JACK | BATTERY | 2018